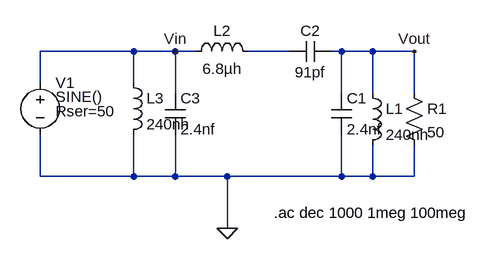
[diagram p0: schematic Bandpass40m.LTspice.asc]
Bandpass40m.LTspice.asc, the LTspice schematic file:
Version 4
SHEET 1 880 680
WIRE 288 224 144 224
WIRE 352 224 288 224
WIRE 384 224 352 224
WIRE 528 224 464 224
WIRE 608 224 592 224
WIRE 656 224 608 224
WIRE 720 224 656 224
WIRE 144 272 144 224
WIRE 288 272 288 224
WIRE 352 288 352 224
WIRE 608 288 608 224
WIRE 656 288 656 224
WIRE 720 288 720 224
WIRE 144 416 144 352
WIRE 288 416 288 352
WIRE 288 416 144 416
WIRE 352 416 352 352
WIRE 352 416 288 416
WIRE 432 416 352 416
WIRE 608 416 608 352
WIRE 608 416 432 416
WIRE 656 416 656 368
WIRE 656 416 608 416
WIRE 720 416 720 368
WIRE 720 416 656 416
WIRE 432 496 432 416
FLAG 720 224 Vout
FLAG 432 496 0
FLAG 352 224 Vin
SYMBOL voltage 144 256 R0
WINDOW 3 24 38 Left 2
WINDOW 39 24 60 Left 2
SYMATTR Value SINE()
SYMATTR SpiceLine Rser=50
SYMATTR InstName V1
SYMATTR Value2 AC 1
SYMBOL res 704 272 R0
SYMATTR InstName R1
SYMATTR Value 50
SYMBOL cap 336 288 R0
SYMATTR InstName C3
SYMATTR Value 2.4nf
SYMBOL cap 592 288 R0
SYMATTR InstName C1
SYMATTR Value 2.4nf
SYMBOL ind 368 240 R270
WINDOW 0 32 56 VTop 2
WINDOW 3 5 56 VBottom 2
SYMATTR InstName L2
SYMATTR Value 6.8µh
SYMBOL ind 640 272 R0
SYMATTR InstName L1
SYMATTR Value 240nh
SYMBOL ind 272 256 R0
SYMATTR InstName L3
SYMATTR Value 240nh
SYMBOL cap 592 208 R90
WINDOW 0 0 32 VBottom 2
WINDOW 3 32 32 VTop 2
SYMATTR InstName C2
SYMATTR Value 91pf
TEXT 504 472 Left 2 !.ac dec 1000 1meg 100meg

The netlist it stands for:
* Bandpass40m.LTspice.asc
V1 Vin 0 SINE() AC 1 Rser=50
R1 Vout 0 50
C3 Vin 0 2.4nf
C1 Vout 0 2.4nf
L2 Vin N001 6.8µh
L1 Vout 0 240nh
L3 Vin 0 240nh
C2 Vout N001 91pf
.ac dec 1000 1meg 100meg
.backanno
.end

* Results of the author's LTspice run, read from the files saved beside the schematic
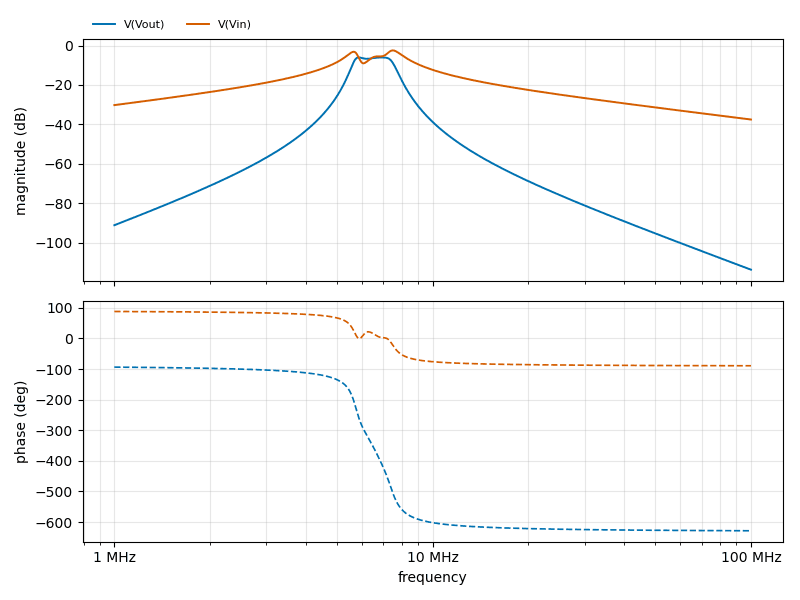
[diagram p1: AC Analysis of Bandpass40m.LTspice.asc, plotted from the saved traces]
* AC Analysis, 1 run:
*   V(Vout): -91.08 dB at 1 MHz, -113.62 dB at 100 MHz, peak -6.03 dB at 5.848 MHz, 3 dB below the peak at 5.622 MHz and 7.51 MHz
*   V(Vin): -30.21 dB at 1 MHz, -37.51 dB at 100 MHz, peak -2.48 dB at 7.499 MHz, 3 dB below the peak at 6.914 MHz and 8.103 MHz